# Altium project GNSS_Compass.PrjPcb
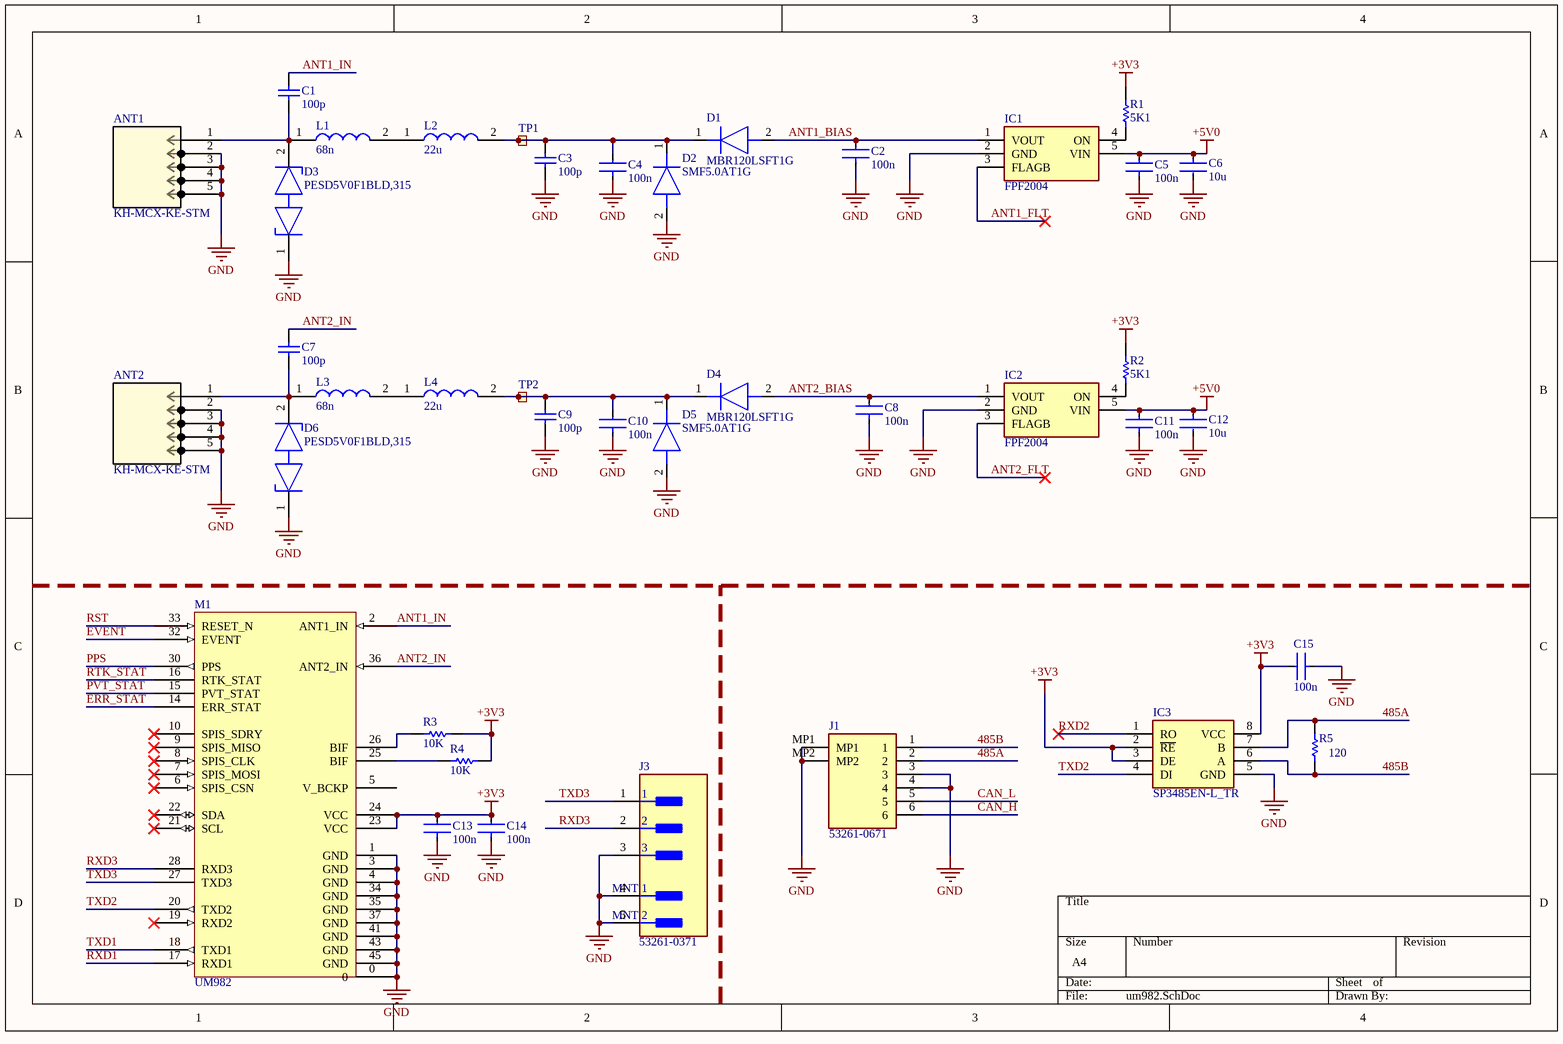
[diagram p0: um982.SchDoc]
3 sheets, 81 parts. Net scope: global (net labels, ports and power ports of the same name join across sheets).
Board file: um982.PcbDoc
Sheets:
  um982.SchDoc
  IMU.SchDoc
  POWER.SchDoc

## Sheet um982.SchDoc
size A4; SheetNumber: 1; SheetTotal: 3

### Parts
ANT1  KH-MCX-KE-STM  [MCX-SMD_KH-MCX-KE-STM]
ANT2  KH-MCX-KE-STM  [MCX-SMD_KH-MCX-KE-STM]
C1  value 100p  [CAPC1005X55X25ML05T10]  (hidden comment: GRM1555C1H101JA01D)
C2  value 100n  [FP-C1005-050-0_05-IPC_C]  (hidden comment: C1005X7R1H104K050BB)
C3  value 100p  [CAPC1005X55X25ML05T10]  (hidden comment: GRM1555C1H101JA01D)
C4  value 100n  [FP-C1005-050-0_05-IPC_A]  (hidden comment: C1005X7R1H104K050BB)
C5  value 100n  [FP-C1005-050-0_05-IPC_C]  (hidden comment: C1005X7R1H104K050BB)
C6  value 10u  [FP-C1608-080-IPC_A]  (hidden comment: C1608X5R1E106M080AC)
C7  value 100p  [CAPC1005X55X25ML05T10]  (hidden comment: GRM1555C1H101JA01D)
C8  value 100n  [FP-C1005-050-0_05-IPC_C]  (hidden comment: C1005X7R1H104K050BB)
C9  value 100p  [CAPC1005X55X25ML05T10]  (hidden comment: GRM1555C1H101JA01D)
C10  value 100n  [FP-C1005-050-0_05-IPC_A]  (hidden comment: C1005X7R1H104K050BB)
C11  value 100n  [FP-C1005-050-0_05-IPC_C]  (hidden comment: C1005X7R1H104K050BB)
C12  value 10u  [FP-C1608-080-IPC_A]  (hidden comment: C1608X5R1E106M080AC)
C13  value 100n  [FP-C1005-050-0_05-IPC_A]  (hidden comment: C1005X7R1H104K050BB)
C14  value 100n  [FP-C1005-050-0_05-IPC_A]  (hidden comment: C1005X7R1H104K050BB)
C15  value 100n  [FP-C1005-050-0_05-IPC_C]  (hidden comment: C1005X7R1H104K050BB)
D1  MBR120LSFT1G  [SODFL3616X98N]
D2  SMF5.0AT1G  [SODFL3616X98N]
D3  PESD5V0F1BLD,315  [FP-SOD882D-MFG]
D4  MBR120LSFT1G  [SODFL3616X98N]
D5  SMF5.0AT1G  [SODFL3616X98N]
D6  PESD5V0F1BLD,315  [FP-SOD882D-MFG]
IC1  FPF2004  [SOT65P210X110-5N]
IC2  FPF2004  [SOT65P210X110-5N]
IC3  SP3485EN-L_TR  [SOIC127P600X175-8N]
J1  53261-0671  [532610671]
J3  53261-0371  [FP-53261-0371-MFG]
L1  value 68n  [LQG15WH0N7B02D]  (hidden comment: LQG15HS68NJ02D)
L2  value 22u  [INDM4532X340N]  (hidden comment: NL453232T-220J-PF)
L3  value 68n  [LQG15WH0N7B02D]  (hidden comment: LQG15HS68NJ02D)
L4  value 22u  [INDM4532X340N]  (hidden comment: NL453232T-220J-PF)
M1  UM982  [UM982]
R1  value 5K1  [RESC1005X40X25NL05T10]  (hidden comment: RC0402FR-075K1L)
R2  value 5K1  [RESC1005X40X25NL05T10]  (hidden comment: RC0402FR-075K1L)
R3  value 10K  [RESC1005X40X25LL05T10]  (hidden comment: RC0402FR-0710KL)
R4  value 10K  [RESC1005X40X25LL05T10]  (hidden comment: RC0402FR-0710KL)
R5  value 120  [RESC1005X40X25NL05T10]  (hidden comment: RC0402FR-07120RL)
TP1  Ø1.0mm,SMD  [TP_SMD_Ø1.0mm]  (value not drawn)  (no BOM)
TP2  Ø1.0mm,SMD  [TP_SMD_Ø1.0mm]  (value not drawn)  (no BOM)

### Nets
+3V3: C13.2 C14.2 C15.2 IC3.2(~{RE}) IC3.3(DE) IC3.8(VCC) M1.23(VCC) M1.24(VCC) R1.1 R2.1 R3.1 R4.1
+5V0: C5.2 C6.1 C11.2 C12.1 IC1.5(VIN) IC2.5(VIN)
GND: ANT1.2(GND) ANT1.3(GND) ANT1.4(GND) ANT1.5(GND) ANT2.2(GND) ANT2.3(GND) ANT2.4(GND) ANT2.5(GND) C2.1 C3.2 C4.1 C5.1 C6.2 C8.1 C9.2 C10.1 C11.1 C12.2 C13.1 C14.1 C15.1 D2.2(A) D3.1(cathode(diode_1)) D5.2(A) D6.1(cathode(diode_1)) IC1.2(GND) IC2.2(GND) IC3.5(GND) J1.3 J1.4 J1.MP1 J1.MP2 J3.3 J3.4(MNT_1) J3.5(MNT_2) M1.0 M1.1(GND) M1.3(GND) M1.4(GND) M1.34(GND) M1.35(GND) M1.37(GND) M1.41(GND) M1.43(GND) M1.45(GND)
485A: IC3.7(B) J1.2 R5.2
485B: IC3.6(A) J1.1 R5.1
ANT1_BIAS: C2.2 D1.2(A) IC1.1(VOUT)
ANT1_FLT: IC1.3(FLAGB)
ANT1_IN: C1.2 M1.2(ANT1_IN)
ANT2_BIAS: C8.2 D4.2(A) IC2.1(VOUT)
ANT2_FLT: IC2.3(FLAGB)
ANT2_IN: C7.2 M1.36(ANT2_IN)
CAN_H: J1.6
CAN_L: J1.5
ERR_STAT: M1.14(ERR_STAT)
EVENT: M1.32(EVENT)
PPS: M1.30(PPS)
PVT_STAT: M1.15(PVT_STAT)
RST: M1.33(RESET_N)
RTK_STAT: M1.16(RTK_STAT)
RXD1: M1.17(RXD1)
RXD2: IC3.1(RO)
RXD3: J3.2 M1.28(RXD3)
TXD1: M1.18(TXD1)
TXD2: IC3.4(DI) M1.20(TXD2)
TXD3: J3.1 M1.27(TXD3)
NetANT1_1: ANT1.1(SIGNAL) C1.1 D3.2(cathode(diode_2)) L1.1
NetANT2_1: ANT2.1(SIGNAL) C7.1 D6.2(cathode(diode_2)) L3.1
NetC3_1: C3.1 C4.2 D1.1(K) D2.1(K) L2.2 TP1.1
NetC9_1: C9.1 C10.2 D4.1(K) D5.1(K) L4.2 TP2.1
NetIC1_4: IC1.4(ON) R1.2
NetIC2_4: IC2.4(ON) R2.2
NetL1_2: L1.2 L2.1
NetL3_2: L3.2 L4.1
NetM1_25: M1.25(BIF) R4.2
NetM1_26: M1.26(BIF) R3.2

Not connected (* = marked no-connect by the designer): M1 5(V_BCKP) 6(SPIS_CSN)* 7(SPIS_MOSI)* 8(SPIS_CLK)* 9(SPIS_MISO)* 10(SPIS_SDRY)* 19(RXD2)* 21(SCL)* 22(SDA)*

### Library data of the parts
ANT1 ANT2 = 919-415J-71P12G: No Description Available; Manufacturer_Name: Amphenol ICC; Type: Coaxial Connectors(RF) Assemblies; Copyright: Copyright (C) 2025 Ultra Librarian. All rights reserved.; Manufacturer_Part_Number: 919-415J-71P12G; RefDes: RefDes
C1 C3 C7 C9 = CMP-2008-03915-1: Manufacturer: Murata; Part Number: GRM1555C1H101JA01D
C2 C4 C5 C8 C10 C11 C13-C15 = CMP-2000-05393-2: Multilayer Ceramic Capacitors 100nF ±10% 50V X7R SMD 0402; Voltage: 50V; Dielectric Material: Ceramic; Min Operating Temperature: -55°C; Depth: 0.5mm; Radiation Hardening: No; RoHS Compliant: Yes; Voltage Rating (DC): 50V; Lead Free: Lead Free; Resistor Type: Ceramic; Height: 0.5mm; Dielectric: X7R; Thickness: 0.022inch; Case/Package: 0402; Case Code (Metric): 1005; Termination: SMD/SMT; Capacitance: 100nF; Packaging: Tape and Reel; Max Operating Temperature: 125°C; Mount: Surface Mount; Package Quantity: 1; Width: 0.02inch; Weight: 2.3E-05oz; Voltage Rating: 50V; Tolerance: 10%; Construction: Flat; Case Code (Imperial): 0402; Length: 1mm; REACH SVHC: No SVHC; Series: C
C6 C12 = CMP-2000-05442-2: CAP CER 10UF 25V X5R 0603; Dielectric Material: Ceramic; Tolerance: 20%; Dielectric: X5R; Length: 1.6mm; Termination: SMD/SMT; Depth: 0.8mm; RoHS Compliant: Yes; Construction: Flat; Weight: 7.1E-05oz; Thickness: 0.039inch; Packaging: Tape and Reel; Min Operating Temperature: -55°C; Case Code (Imperial): 0603; Case/Package: 0603; Height: 0.8mm; Case Code (Metric): 1608; Voltage Rating: 25V; Resistor Type: Ceramic; Voltage Rating (DC): 25V; Max Operating Temperature: 85°C; REACH SVHC: No SVHC; Lead Free: Lead Free; Series: C; Width: 0.8mm; Mount: Surface Mount; Package Quantity: 1; Capacitance: 10uF
D1 D4 = MBR120LSFT1G: Diode; Manufacturer_Name: onsemi; Datasheet Link: https://www.onsemi.com/pub/Collateral/MBR120LSFT1-D.PDF; Height: 0.98mm; Manufacturer_Part_Number: MBR120LSFT1G; Mouser Part Number: 863-MBR120LSFT1G; Mouser Price/Stock: https://www.mouser.co.uk/ProductDetail/onsemi/MBR120LSFT1G?qs=3JMERSakebpX1t8rvRkaxg%3D%3D; Arrow Part Number: MBR120LSFT1G; Arrow Price/Stock: https://www.arrow.com/en/products/mbr120lsft1g/on-semiconductor?utm_currency=USD&region=nac
D2 D5 = SMF5.0AT1G: Diode; Manufacturer_Name: onsemi; Datasheet Link: https://datasheet.datasheetarchive.com/originals/distributors/SFDatasheet-3/sf-00077388.pdf; Height: 0.98mm; Manufacturer_Part_Number: SMF5.0AT1G; Mouser Part Number: 863-SMF5.0AT1G; Mouser Price/Stock: http://www.mouser.com/Search/ProductDetail.aspx?qs=OSf9jACorva5lys2KCgYOA%3d%3d
D3 D6 = CMP-14432-000003-1: TVS DIODE 5.5V 15V 2DFN1006D; RoHS Compliant: Yes
IC1 IC2 = FPF2004: Integrated Circuit; Manufacturer_Name: onsemi; Datasheet Link: https://www.onsemi.com/pub/Collateral/FPF2001-D.PDF; Height: 1.1mm; Manufacturer_Part_Number: FPF2004; Mouser Part Number: 512-FPF2004; Mouser Price/Stock: https://www.mouser.co.uk/ProductDetail/onsemi-Fairchild/FPF2004?qs=lYuAOLy5nvYlXtSUPYB80A%3D%3D; Arrow Part Number: FPF2004; Arrow Price/Stock: https://www.arrow.com/en/products/fpf2004/on-semiconductor
IC3 = SP3485EN-L_TR: Integrated Circuit; Manufacturer_Name: MaxLinear; Manufacturer_Part_Number: SP3485EN-L/TR; Datasheet Link: https://www.maxlinear.com/ds/sp3485.pdf; Height: 1.75mm; Mouser Part Number: 701-SP3485EN-L/TR; Mouser Price/Stock: https://www.mouser.co.uk/ProductDetail/MaxLinear/SP3485EN-L-TR?qs=3EMgrMjM0fbQ17liGrle%2Fg%3D%3D; Arrow Part Number: SP3485EN-L/TR; Arrow Price/Stock: https://www.arrow.com/en/products/sp3485en-ltr/maxlinear-inc?region=nac
J1 = 53261-0671: Connector; Manufacturer_Name: Molex; Datasheet Link: https://www.molex.com/pdm_docs/sd/532610671_sd.pdf; Height: 3.6mm; Manufacturer_Part_Number: 53261-0671; Mouser Part Number: 538-53261-0671; Mouser Price/Stock: https://www.mouser.co.uk/ProductDetail/Molex/53261-0671?qs=%252B72YyncTwW9Wyr77z4J2cA%3D%3D; Arrow Part Number: 53261-0671; Arrow Price/Stock: https://www.arrow.com/en/products/53261-0671/molex?region=nac
J3 = CMP-04776-000071-1: CONN HEADER SMD R/A 3POS 1.25MM; Manufacturer: Molex; Number Of Contacts: 3; Conn Orientation: Right Angle; Current Rating: 1A; Voltage Rating: 125V; Conn Gender: Male; Category: Conn; Automotive: No; Footprint Url: https://www.molex.com/pdm_docs/sd/532610371_sd.pdf; Height: 3.6mm; Number Of Rows: 1; Temperature Range Low: -40°C; Package: 0; Octopart: https://octopart.com/53261-0371-molex-655314; ComponentLink2Description: Datasheet; Lead Free: Yes; Ambient Temperature Range Low: -40°C; Device Class L3: unset; Mouser Description: 1.25mm (.049") Pitch PicoBlade Header, Surface Mount, Right Angle, Lead-free, 3 Circuits; Digikey Description: CONN HEADER SMD R/A 3POS 1.25MM; Device Class L2: Headers and Wire Housings; Contact Material: Tin,Nickel; Manufacturer Part Number: 53261-0371; Ambient Temperature Range High: +105°C; ComponentLink2URL: https://www.molex.com/webdocs/datasheets/pdf/en-us/0532610371_PCB_HEADERS.pdf; Pitch: 1.25mm; Temperature: -40°C to +105°C; RoHS: TRUE; Device Class L1: Connectors; Temperature Range High: +105°C
L1 L3 = LQG15HS68NJ02D: Inductor; Manufacturer_Name: Murata Electronics; Datasheet Link: https://search.murata.co.jp/Ceramy/image/img/P02/JELF243B-0010.pdf; Height: 0.6mm; Manufacturer_Part_Number: LQG15HS68NJ02D; Mouser Part Number: 81-LQG15HS68NJ02D; Mouser Price/Stock: https://www.mouser.co.uk/ProductDetail/Murata-Electronics/LQG15HS68NJ02D?qs=%252BvdzeT3otYvc8aHGlFkb4Q%3D%3D; Arrow Part Number: LQG15HS68NJ02D; Arrow Price/Stock: https://www.arrow.com/en/products/lqg15hs68nj02d/murata-manufacturing?region=nac
L2 L4 = NL453232T-220J-PF: Inductor; Manufacturer_Name: TDK; Datasheet Link: https://product.tdk.com/system/files/dam/doc/product/inductor/inductor/smd/catalog/inductor_commercial_standard_nl453232_en.pdf; Height: 3.4mm; Manufacturer_Part_Number: NL453232T-220J-PF; Mouser Part Number: 810-NL453232T-220JPF; Mouser Price/Stock: https://www.mouser.co.uk/ProductDetail/TDK/NL453232T-220J-PF?qs=qikLf3I1oVVds9cZ5k413A%3D%3D; Arrow Part Number: NL453232T-220J-PF; Arrow Price/Stock: https://www.arrow.com/en/products/nl453232t-220j-pf/tdk
M1 = UM982: All-constellation Multi-frequencyHigh Precision Positioning & Heading Module
R1 R2 = CMP-2002-07753-1: Manufacturer: Yageo / Phycomp; Part Number: RC0402FR-075K1L
R3 R4 = CMP-2002-07353-1: Manufacturer: Yageo / Phycomp; Part Number: RC0402FR-0710KL
R5 = CMP-2002-07370-1: Manufacturer: Yageo / Phycomp; Part Number: RC0402FR-07120RL
TP1 TP2 = TP_SMD_Ø1.0MM: 1.0mm circular SMD testpad; Manufacturer: Nordic Semiconductor; Manufacturer Part Number: N.A.; Pad Count: 1; Part Number: TP_SMD_Ø1.0MM; LatestRevisionDate: 2013-06-11; Published: 2013-06-11; Value: Ø1.0mm,SMD; Note: N.A.; Artikkelnr Noca: N.A.; Footprint Doc: TP_SMD_Ø1.0mm; Part number IPS: N.A.; ComponentLink1URL: N.A.; ComponentLink1Description: Datasheet; ComponentLink2URL: N.A.; ComponentLink2Description: Supplier link; HelpURL: N.A.; Supplier 1: N.A.; Supplier Part Number 1: N.A.; Supplier 2: N.A.; Supplier Part Number 2: N.A.; Component Class: Connectors; PartId: 100500475

## Sheet IMU.SchDoc
size A; SheetNumber: 2; SheetTotal: 3
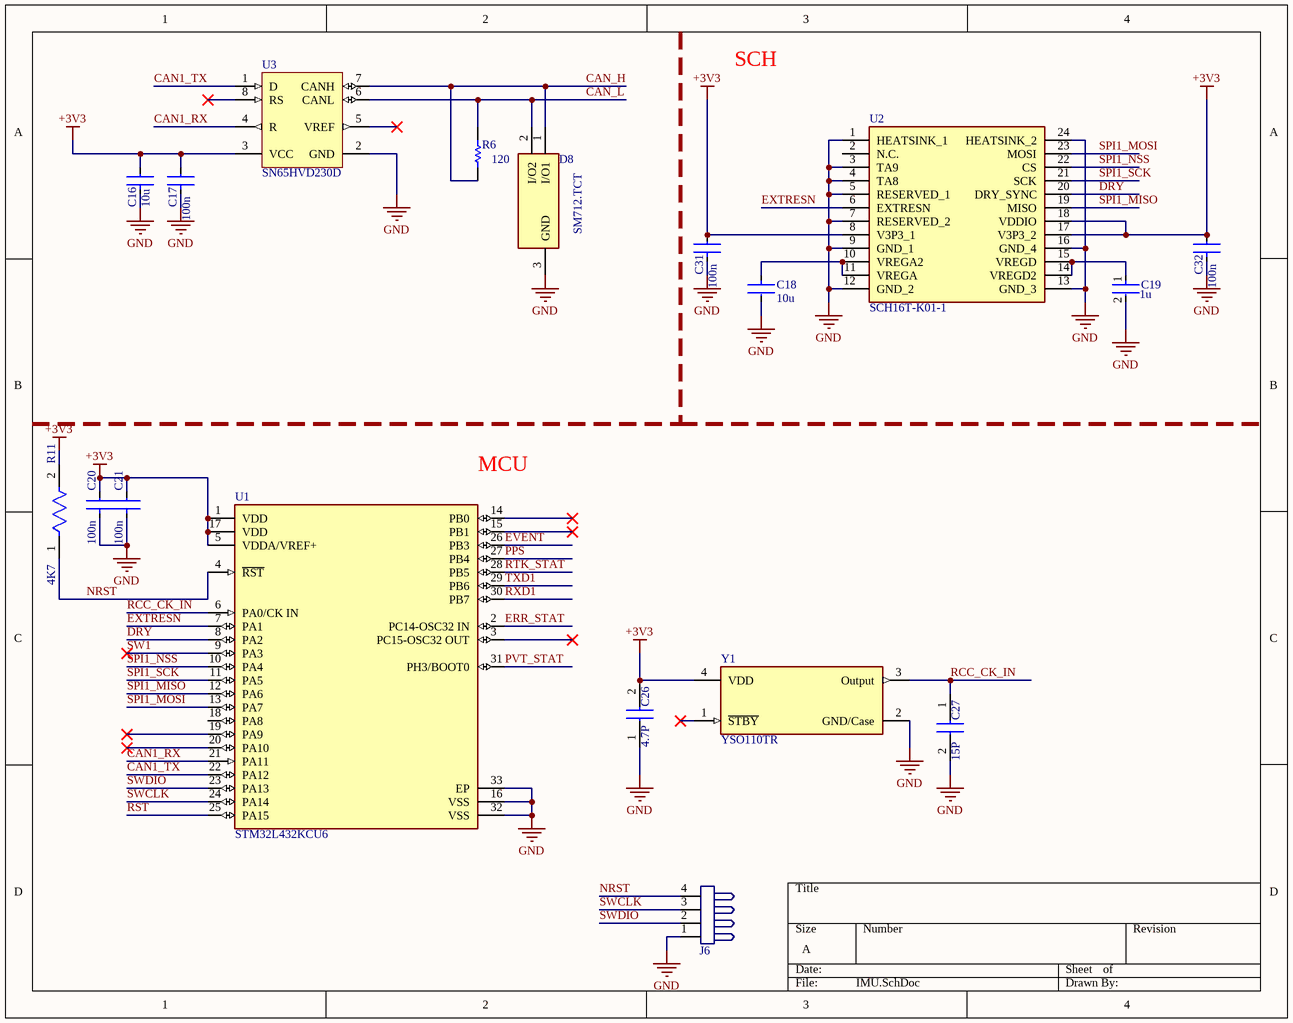
[diagram p1: IMU.SchDoc]

### Parts
C16  value 10u  [FP-C1608-080-IPC_A]  (hidden comment: C1608X5R1E106M080AC)
C17  value 100n  [FP-C1005-050-0_05-IPC_C]  (hidden comment: C1005X7R1H104K050BB)
C18  value 10u  [FP-C1608-080-IPC_A]  (hidden comment: C1608X5R1E106M080AC)
C19  Capacitance: 1u  [FP-C1005-050-0_05-IPC_C]  (hidden comment: C1005X5R1V105K050BC)
C20  value 100n  [FP-C1005-050-0_05-IPC_C]  (hidden comment: C1005X7R1H104K050BB)
C21  value 100n  [FP-C1005-050-0_05-IPC_C]  (hidden comment: C1005X7R1H104K050BB)
C26  value 4.7P  [CAPC1005X55N]  (hidden comment: CC0402BRNPO9BN4R7)
C27  value 15P  [CAPC1005X55N]  (hidden comment: CC0402JRNPO8BN150)
C31  value 100n  [FP-C1005-050-0_05-IPC_C]  (hidden comment: C1005X7R1H104K050BB)
C32  value 100n  [FP-C1005-050-0_05-IPC_C]  (hidden comment: C1005X7R1H104K050BB)
D8  SM712.TCT  [SOT95P237X112-3N]
J6  PHDR 4  [PHDR2X2]  (value not drawn)
R6  value 120  [RESC1005X40X25NL05T10]  (hidden comment: RC0402FR-07120RL)
R11  value 4K7  [FP-RC0402-0_4-MFG]  (hidden comment: RC0402JR-074K7L)
U1  STM32L432KCU6  [FP-UFQFPN32-A0B8-MFG]
U2  SCH16T-K01-1  [SCH16TK011]
U3  SN65HVD230D  [D0008A_M]
Y1  YSO110TR  [FP-ASE-MFG]

### Nets
+3V3: C16.2 C17.2 C20.2 C21.2 C26.2 C31.2 C32.2 R11.2 U1.1(VDD) U1.5(VDDA/VREF+) U1.17(VDD) U2.8(V3P3_1) U2.17(V3P3_2) U2.18(VDDIO) U3.3(VCC) Y1.4(VDD)
GND: C16.1 C17.1 C18.2 C19.2 C20.1 C21.1 C26.1 C27.2 C31.1 C32.1 D8.3(GND) J6.1 U1.16(VSS) U1.32(VSS) U1.33(EP) U2.1(HEATSINK_1) U2.3(TA9) U2.4(TA8) U2.5(RESERVED_1) U2.7(RESERVED_2) U2.9(GND_1) U2.12(GND_2) U2.13(GND_3) U2.16(GND_4) U2.24(HEATSINK_2) U3.2(GND) Y1.2(GND/Case)
CAN1_RX: U1.21(PA11) U3.4(R)
CAN1_TX: U1.22(PA12) U3.1(D)
CAN_H: D8.1(I/O1) R6.1 U3.7(CANH)
CAN_L: D8.2(I/O2) R6.2 U3.6(CANL)
DRY: U1.8(PA2) U2.20(DRY_SYNC)
ERR_STAT: U1.2(PC14-OSC32_IN)
EVENT: U1.26(PB3)
EXTRESN: U1.7(PA1) U2.6(EXTRESN)
NRST: J6.4 R11.1 U1.4(~{RST})
PPS: U1.27(PB4)
PVT_STAT: U1.31(PH3/BOOT0)
RCC_CK_IN: C27.1 U1.6(PA0/CK_IN) Y1.3(Output)
RST: U1.25(PA15)
RTK_STAT: U1.28(PB5)
RXD1: U1.30(PB7)
SPI1_MISO: U1.12(PA6) U2.19(MISO)
SPI1_MOSI: U1.13(PA7) U2.23(MOSI)
SPI1_NSS: U1.10(PA4) U2.22(CS)
SPI1_SCK: U1.11(PA5) U2.21(SCK)
SW1: U1.9(PA3)
SWCLK: J6.3 U1.24(PA14)
SWDIO: J6.2 U1.23(PA13)
TXD1: U1.29(PB6)
NetC18_1: C18.1 U2.10(VREGA2) U2.11(VREGA)
NetC19_1: C19.1 U2.14(VREGD2) U2.15(VREGD)

Not connected (* = marked no-connect by the designer): U1 3(PC15-OSC32_OUT)* 14(PB0)* 15(PB1)* 18(PA8) 19(PA9)* 20(PA10)*; U2 2(N.C.); U3 5(VREF)* 8(RS)*; Y1 1(~{STBY})*

### Notes on the sheet
- SCH
- (near U1) MCU

### Library data of the parts
C16 C18 = CMP-2000-05442-2: as C6 on sheet um982; Dielectric: X5R; Length: 1.6mm; Termination: SMD/SMT; Depth: 0.8mm; RoHS Compliant: Yes; Construction: Flat; Weight: 7.1E-05oz; Thickness: 0.039inch; Packaging: Tape and Reel; Min Operating Temperature: -55°C; Case Code (Imperial): 0603; Case/Package: 0603; Height: 0.8mm; Case Code (Metric): 1608; Voltage Rating: 25V; Resistor Type: Ceramic; Voltage Rating (DC): 25V; Max Operating Temperature: 85°C; REACH SVHC: No SVHC; Lead Free: Lead Free; Series: C; Width: 0.8mm; Mount: Surface Mount; Package Quantity: 1; Capacitance: 10uF
C17 C20 C21 C31 C32 = CMP-2000-05393-2: as C2 on sheet um982; Voltage: 50V; Dielectric Material: Ceramic; Min Operating Temperature: -55°C; Depth: 0.5mm; Radiation Hardening: No; RoHS Compliant: Yes; Voltage Rating (DC): 50V; Lead Free: Lead Free; Resistor Type: Ceramic; Height: 0.5mm; Dielectric: X7R; Thickness: 0.022inch; Case/Package: 0402; Case Code (Metric): 1005; Termination: SMD/SMT; Capacitance: 100nF; Packaging: Tape and Reel; Max Operating Temperature: 125°C; Mount: Surface Mount; Package Quantity: 1; Width: 0.02inch; Weight: 2.3E-05oz; Voltage Rating: 50V; Tolerance: 10%; Construction: Flat; Case Code (Imperial): 0402; Length: 1mm; REACH SVHC: No SVHC; Series: C
C19 = CMP-2000-06004-2: Multilayer Ceramic Capacitors 1μF ±10% 35V X5R SMD 0402; Series: C; Voltage Rating (DC): 35V; Max Operating Temperature: 85°C; Resistor Type: Ceramic; REACH SVHC: No SVHC; Package Quantity: 1; Packaging: Tape and Reel; Termination: SMD/SMT; Dielectric Material: Ceramic; Height: 0.5mm; Length: 1mm; Min Operating Temperature: -55°C; Dielectric: X5R; Thickness: 0.022inch; Lead Free: Lead Free; Voltage Rating: 35V; Width: 0.02inch; Depth: 0.5mm; Case Code (Imperial): 0402; Case/Package: 0402; Tolerance: 10%; Weight: 2.3E-05oz; Radiation Hardening: No; RoHS Compliant: Yes; Case Code (Metric): 1005; Mount: Surface Mount
C26 = CC0402BRNPO9BN4R7: Capacitor; Manufacturer_Name: KEMET; Datasheet Link: https://4donline.ihs.com/images/VipMasterIC/IC/YAGO/YAGO-S-A0009251638/YAGO-S-A0009251638-1.pdf?hkey=6D3A4C79FDBF58556ACFDE234799DDF0; Height: 0.55mm; Manufacturer_Part_Number: CC0402BRNPO9BN4R7; Mouser Part Number: 603-CC402BRNPO9BN4R7; Mouser Price/Stock: https://www.mouser.co.uk/ProductDetail/Yageo/CC0402BRNPO9BN4R7?qs=AgBp2OyFlx%2FGrCNlQaiLcg%3D%3D; Arrow Part Number: CC0402BRNPO9BN4R7; Arrow Price/Stock: https://www.arrow.com/en/products/cc0402brnpo9bn4r7/yageo
C27 = CC0402JRNPO8BN150: Capacitor; Manufacturer_Name: KEMET; Datasheet Link: https://www.mouser.com/datasheet/2/447/UPY-GP_NP0_16V-to-50V_16-1109089.pdf; Height: 0.55mm; Manufacturer_Part_Number: CC0402JRNPO8BN150; Mouser Part Number: 603-CC402JRNPO8BN150; Mouser Price/Stock: https://www.mouser.com/Search/Refine.aspx?Keyword=603-CC402JRNPO8BN150; Arrow Part Number: CC0402JRNPO8BN150; Arrow Price/Stock: https://www.arrow.com/en/products/cc0402jrnpo8bn150/yageo
D8 = SM712.TCT: Diode; Manufacturer_Name: SEMTECH; Datasheet Link: https://datasheet.datasheetarchive.com/originals/distributors/Datasheets-30/DSA-588511.pdf; Height: 1.12mm; Manufacturer_Part_Number: SM712.TCT; Mouser Part Number: 947-SM712.TCT; Mouser Price/Stock: https://www.mouser.co.uk/ProductDetail/Semtech/SM712.TCT?qs=rBWM4%252BvDhIfYU4k7Soov1w%3D%3D; Arrow Part Number: SM712.TCT; Arrow Price/Stock: https://www.arrow.com/en/products/sm712.tct/semtech?utm_currency=USD&region=nac
J6 = PHDR 4: PinHeader
R6 = CMP-2002-07370-1: Manufacturer: Yageo / Phycomp; Part Number: RC0402FR-07120RL
R11 = CMP-2002-08011-2: Tolerance: 5%; Power Rating: 63mW; Voltage Rating: 50V; Temperature Coefficient: 100ppm/°C; Composition: Thick Film; Max Operating Temperature: 155°C; Case/Package: 0402; Depth: 500µm; Packaging: Tape & Reel; Number of Pins: 2; Schedule B: 8533210045, 8533210045; Case Code (Imperial): 0402; Termination: SMD/SMT; Military Standard: Not; Lead Free: Lead Free; Width: 500µm; REACH SVHC: No SVHC; Max Power Dissipation: 63mW; Voltage Rating (AC): 50V; Features: Moisture Resistant; Min Operating Temperature: -55°C; Number of Terminations: 2; RoHS: Compliant; Height: 350µm; Voltage Rating (DC): 50V; Length: 1mm
U1 = CMP-12105-000033-1: IC MCU 32BIT 256KB FLASH 32QFPN; Manufacturer: STMicroelectronics; Max Supply Voltage: 3.6V; Number Of Timers/Counters: 11; Ram Size: 64KBytes; Number Of Usb Channels: 1; Memory Size: 256KBytes; Number Of Uart Channels: 3; Frequency: 80MHz; Number Of I2C Channels: 2; Core Architecture: ARM Cortex-M4; Number Of I/Os: 26; Min Supply Voltage: 1.62V; Data Bus Width: 32bits; Max Junction Temp: +105°C; Interface: I2C,SPI,UART,USART,CAN,USB,LIN,IrDA,Other; Ambient Temperature Range High: +85°C; Category: IC; Device Class L2: Embedded Processors and Controllers; Ambient Temperature Range Low: -40°C; Number Of Adc Channels: 11; ComponentLink2Description: Datasheet; Number Of A/D Converters: 1; Device Class L1: Integrated Circuits (ICs); Memory Type: FLASH; Height: 0.6mm; Temperature: -40°C to +105°C; Automotive: No; Temperature Range Low: -40°C; Digikey Description: IC MCU 32BIT 256KB FLASH 32QFPN; Manufacturer Part Number: STM32L432KCU6; Temperature Range High: +105°C; Octopart: https://octopart.com/stm32l432kcu6-stmicroelectronics-71093510; Device Class L3: Microcontrollers; Number Of Pwm Channels: 1; Number Of Spi Channels: 2; Lead Free: Yes; Number Of Cores: 1; Package: UFQFPN32-A0B8; ComponentLink2URL: https://www.st.com/content/ccc/resource/technical/document/datasheet/24/01/9f/59/f0/83/47/fc/DM00257205.pdf/files/DM00257205.pdf/jcr:content/translations/en.DM00257205.pdf; RoHS: TRUE
U2 = SCH16T-K01-1: Undefined or Miscellaneous; Manufacturer_Name: Murata Electronics; Datasheet Link: https://www.murata.com/-/media/webrenewal/products/sensor/pdf/datasheet/datasheet-sch16t-series-short.ashx?la=en-us&cvid=20240110024121000000; Height: 3mm; Manufacturer_Part_Number: SCH16T-K01-1; Mouser Part Number: 81-SCH16T-K01-1; Mouser Price/Stock: https://www.mouser.co.uk/ProductDetail/Murata-Electronics/SCH16T-K01-1?qs=HFfMDpzxxd0hctvcENbFhg%3D%3D; Arrow Part Number: SCH16T-K01-1; Arrow Price/Stock: https://www.arrow.com/en/products/sch16t-k01-1/murata-manufacturing?utm_currency=USD&region=nac
U3 = CMP-0315-00046-3: CAN Bus Transceiver, 3.3 V, -40 to 85 degC, 8-Pin SOIC (D), Green (RoHS & no Sb/Br), Tube; Supply Voltage Min: 3 V; Supply Voltage Max: 3.6 V; PartNumber: SN65HVD230D; ComponentLink2URL: http://www.ti.com/general/docs/lit/getliterature.tsp?genericGeneric Part Number=SN65HVD230&fileType=pdf; DatasheetVersion: SLOS346N; Generic Part Number: SN65HVD230; Packing: Tube; Temperature Min: -40 degC; Temperature Max: 85 degC; ComponentLink1Description: Manufacturer URL; Mounting Technology: Surface Mount; RoHS: TRUE; ComponentLink1URL: http://www.ti.com/; ComponentLink2Description: Datasheet; PackageDescription: 8-Pin Plastic Small Outline, Body 4.9 x 3.9 mm, Pitch 1.27 mm
Y1 = CMP-27762-009764-1: XTAL Oscillator 50MHz ±50ppm CMOS 3.3V 4-SMD 3.2mm x 2.5mm; Load Capacitance: 15pF; Max Supply Current: 19mA; Min Supply Voltage: 3.135V; Max Supply Voltage: 3.465V; Packaging: Tape and Reel; Height: 0.047inch; Mount: Surface Mount; Frequency Stability: 50ppm; Lead Free: Lead Free; Number of Pins: 4; Width: 0.098inch; Radiation Hardening: No; Max Operating Temperature: 85°C; Length: 3.2mm; REACH SVHC: No SVHC; Series: ASE; Depth: 2.5mm; Operating Supply Voltage: 3.3V; Min Operating Temperature: -40°C; Package Quantity: 1000; Operating Frequency: 50 MHz; Case/Package: SMD/SMT; Termination: SMD/SMT; Frequency: 50MHz

## Sheet POWER.SchDoc
size A; SheetNumber: 3; SheetTotal: 3
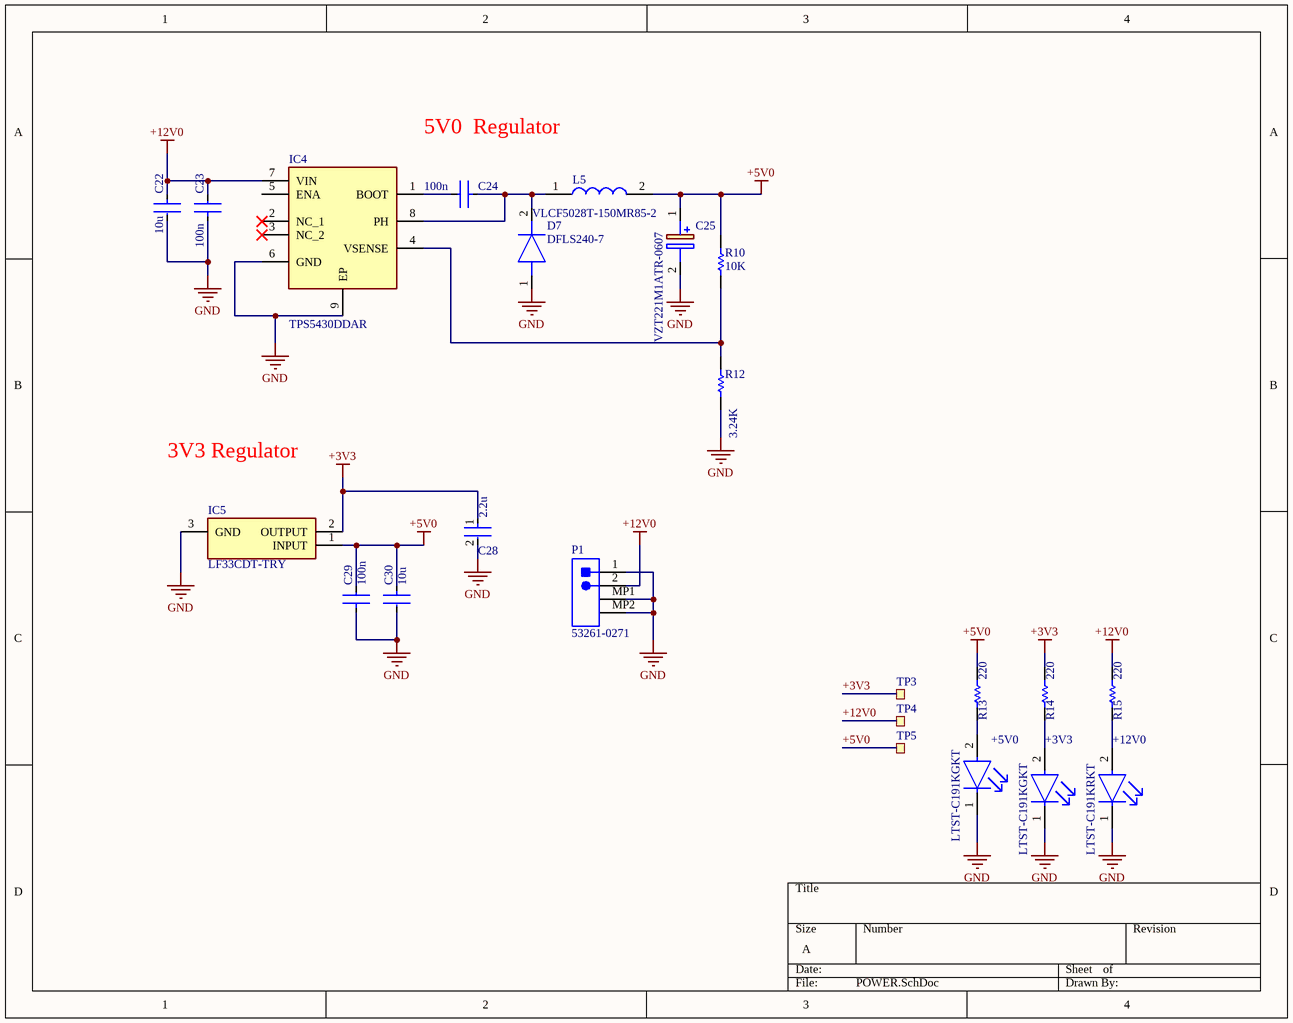
[diagram p2: POWER.SchDoc]

### Parts
+3V3  LTST-C191KGKT  [FP-LTST-C191KGKT-MFG]
+5V0  LTST-C191KGKT  [FP-LTST-C191KGKT-MFG]
+12V0  LTST-C191KRKT  [FP-LTST-C191KRKT-MFG]
C22  value 10u  [FP-C1608-080-IPC_A]  (hidden comment: C1608X5R1E106M080AC)
C23  value 100n  [FP-C1005-050-0_05-IPC_C]  (hidden comment: C1005X7R1H104K050BB)
C24  value 100n  [FP-C1005-050-0_05-IPC_C]  (hidden comment: C1005X7R1H104K050BB)
C25  VZT221M1ATR-0607  [CAPAE660X800N]
C28  Capacitance: 2.2u  [FP-C1005-050-0_15-IPC_A]  (hidden comment: C1005X5R1V225K050BC)
C29  value 100n  [FP-C1005-050-0_05-IPC_C]  (hidden comment: C1005X7R1H104K050BB)
C30  value 10u  [FP-C1608-080-IPC_A]  (hidden comment: C1608X5R1E106M080AC)
D7  DFLS240-7  [POWERDI123]
IC4  TPS5430DDAR  [SOIC127P600X170-9N]
IC5  LF33CDT-TRY  [LD1117DT33]
L5  VLCF5028T-150MR85-2  [VLCF5028]
P1  53261-0271  [MOLX-53261-0271_V]
R10  value 10K  [RESC1005X40X25LL05T10]  (hidden comment: RC0402FR-0710KL)
R12  value 3.24K  [RESC1005X40X25ML05T10]  (hidden comment: RC0402FR-073K24L)
R13  vlue: 220  [RESC1005X40X25ML05T10]  (hidden comment: RC0402FR-13220RL)
R14  vlue: 220  [RESC1005X40X25ML05T10]  (hidden comment: RC0402FR-13220RL)
R15  vlue: 220  [RESC1005X40X25ML05T10]  (hidden comment: RC0402FR-13220RL)
TP3  Ø1.5mm,SMD  [TP_SMD_Ø1.5mm]  (value not drawn)  (no BOM)
TP4  Ø1.5mm,SMD  [TP_SMD_Ø1.5mm]  (value not drawn)  (no BOM)
TP5  Ø1.5mm,SMD  [TP_SMD_Ø1.5mm]  (value not drawn)  (no BOM)

### Nets
+3V3: C28.1 IC5.2(OUTPUT) R14.2 TP3.1
+5V0: C25.1(+) C29.2 C30.1 IC5.1(INPUT) L5.2 R10.1 R13.2 TP5.1
+12V0: C22.1 C23.2 IC4.7(VIN) P1.2 R15.2 TP4.1
GND: +3V3.1(C) +5V0.1(C) +12V0.1(C) C22.2 C23.1 C25.2(-) C28.2 C29.1 C30.2 D7.1(A) IC4.6(GND) IC4.9(EP) IC5.3(GND) P1.1 P1.MP1 P1.MP2 R12.1
Net+3V3_2: +3V3.2(A) R14.1
Net+5V0_2: +5V0.2(A) R13.1
Net+12V0_2: +12V0.2(A) R15.1
NetC24_1: C24.1 D7.2(K) IC4.8(PH) L5.1
NetC24_2: C24.2 IC4.1(BOOT)
NetIC4_4: IC4.4(VSENSE) R10.2 R12.2

Not connected (* = marked no-connect by the designer): IC4 2(NC_1)* 3(NC_2)* 5(ENA)

### Notes on the sheet
- 5V0  Regulator
- 3V3 Regulator

### Library data of the parts
+3V3 +5V0 = CMP-2000-05198-4: NexarPartId: 549907; Forward Voltage: 2V; Viewing Angle: 130°; Lens Transparency: Clear; Power Rating: 75mW; Number of LEDs: 1; Luminous Intensity: 35mcd; Forward Current: 20mA; Dominant Wavelength: 571nm; Illumination Color: Green; Lens Color: Clear, Colorless; Reverse Voltage: 5V; Wavelength: 574nm; Number of Pins: 2; Packaging: Tape and Reel; Number of Elements: 1; Schedule B: 8541402000, 8541402000; Height: 550µm; Case/Package: 0603; Depth: 800µm; Max Operating Temperature: 85°C; RoHS: Compliant; Lens Style: Clear; Lead Free: Lead Free; Length: 1.6mm; Mount: Surface Mount; Test Current: 20mA; Width: 800µm; Case Code (Imperial): 0603; Min Operating Temperature: -55°C; Case Code (Metric): 1608; Radiation Hardening: No; Power Dissipation: 75mW; Color: Green
+12V0 = CMP-2000-05199-2: NexarPartId: 549908; Illumination Color: Red; Lens Transparency: Clear; Luminous Intensity: 54mcd; Current: 2A; Forward Current: 20mA; Number of Elements: 1; Power Rating: 75mW; Lens Color: Colorless; Wavelength: 639nm; Viewing Angle: 130°; Voltage: 2V; Dominant Wavelength: 631nm; Reverse Voltage: 5V; Height: 550µm; Length: 1.6mm; Number of Pins: 2; Packaging: Tape and Reel; Mount: Surface Mount; Case Code (Metric): 1608; Radiation Hardening: No; Case Code (Imperial): 0603; Test Current: 20mA; Number of LEDs: 1; Schedule B: 8541402000, 8541402000; Lead Free: Lead Free; Power Dissipation: 75mW; RoHS: Compliant; Forward Voltage: 2V; Lens Style: Clear; Color: Red; Max Operating Temperature: 85°C; Depth: 800µm; Width: 800µm; Min Operating Temperature: -55°C; Case/Package: 0603
C22 C30 = CMP-2000-05442-2: as C6 on sheet um982; Dielectric: X5R; Length: 1.6mm; Termination: SMD/SMT; Depth: 0.8mm; RoHS Compliant: Yes; Construction: Flat; Weight: 7.1E-05oz; Thickness: 0.039inch; Packaging: Tape and Reel; Min Operating Temperature: -55°C; Case Code (Imperial): 0603; Case/Package: 0603; Height: 0.8mm; Case Code (Metric): 1608; Voltage Rating: 25V; Resistor Type: Ceramic; Voltage Rating (DC): 25V; Max Operating Temperature: 85°C; REACH SVHC: No SVHC; Lead Free: Lead Free; Series: C; Width: 0.8mm; Mount: Surface Mount; Package Quantity: 1; Capacitance: 10uF
C23 C24 C29 = CMP-2000-05393-2: as C2 on sheet um982; Voltage: 50V; Dielectric Material: Ceramic; Min Operating Temperature: -55°C; Depth: 0.5mm; Radiation Hardening: No; RoHS Compliant: Yes; Voltage Rating (DC): 50V; Lead Free: Lead Free; Resistor Type: Ceramic; Height: 0.5mm; Dielectric: X7R; Thickness: 0.022inch; Case/Package: 0402; Case Code (Metric): 1005; Termination: SMD/SMT; Capacitance: 100nF; Packaging: Tape and Reel; Max Operating Temperature: 125°C; Mount: Surface Mount; Package Quantity: 1; Width: 0.02inch; Weight: 2.3E-05oz; Voltage Rating: 50V; Tolerance: 10%; Construction: Flat; Case Code (Imperial): 0402; Length: 1mm; REACH SVHC: No SVHC; Series: C
C25 = VZT221M1ATR-0607: Capacitor Polarised; Manufacturer_Name: Lelon; Datasheet Link: http://www.lelon.com/upload/prod/173631643921.pdf; Height: 8mm; Manufacturer_Part_Number: VZT221M1ATR-0607; Mouser Part Number: 140-VZT221M1ATR-0607; Mouser Price/Stock: https://www.mouser.co.uk/ProductDetail/Lelon/VZT221M1ATR-0607?qs=wd5RIQLrsJgJ%252BgwNNtmauQ%3D%3D
C28 = CMP-08246-007153-1: CAP CER 2.2UF 35V X5R 0402; Dielectric Material: Ceramic; Tolerance: 10%; Package Quantity: 1; Voltage Rating: 35V; Case Code (Metric): 1005; Width: 0.5mm; RoHS Compliant: Yes; Min Operating Temperature: -55°C; Packaging: Tape and Reel; Voltage Rating (DC): 35V; Thickness: 0.022inch; REACH SVHC: No SVHC; Max Operating Temperature: 85°C; Length: 1mm; Case Code (Imperial): 0402; Resistor Type: Ceramic; Lead Free: Lead Free; Series: C; Termination: SMD/SMT; Height: 0.5mm; Mount: Surface Mount; Case/Package: 0402; Weight: 2.3E-05oz; Dielectric: X5R; Depth: 0.5mm
D7 = DFLS240-7: Diode; Manufacturer_Name: Diodes Incorporated; Datasheet Link: https://www.diodes.com//assets/Datasheets/DFLS240.pdf; Manufacturer_Part_Number: DFLS240-7; Mouser Part Number: 621-DFLS240-7; Mouser Price/Stock: https://www.mouser.co.uk/ProductDetail/Diodes-Incorporated/DFLS240-7?qs=mQbszxtPdlOdicBjJF8M2A%3D%3D; Arrow Part Number: DFLS240-7; Arrow Price/Stock: https://www.arrow.com/en/products/dfls240-7/diodes-incorporated?utm_currency=USD&region=europe
IC4 = TPS5430DDAR: Integrated Circuit; Manufacturer_Name: Texas Instruments; Datasheet Link: http://www.ti.com/lit/gpn/tps5430; Height: 1.7mm; Manufacturer_Part_Number: TPS5430DDAR; Mouser Part Number: 595-TPS5430DDAR; Mouser Price/Stock: https://www.mouser.co.uk/ProductDetail/Texas-Instruments/TPS5430DDAR?qs=zwk82MlA57ZJdOTovH1aYA%3D%3D; Arrow Part Number: TPS5430DDAR; Arrow Price/Stock: https://www.arrow.com/en/products/tps5430ddar/texas-instruments?region=nac
IC5 = LF33CDT-TRY: Integrated Circuit; Manufacturer_Name: STMicroelectronics; Datasheet Link: https://www.st.com/resource/en/datasheet/lfxx.pdf; Height: 2mm; Manufacturer_Part_Number: LF33CDT-TRY; Mouser Part Number: 511-LF33CDT-TRY; Mouser Price/Stock: https://www.mouser.co.uk/ProductDetail/STMicroelectronics/LF33CDT-TRY?qs=fnYUjNMxfVBCqlsIwZoKRw%3D%3D; Arrow Part Number: LF33CDT-TRY; Arrow Price/Stock: https://www.arrow.com/en/products/lf33cdt-try/stmicroelectronics?region=nac
L5 = VLCF5028T-150MR85-2: Inductor; Manufacturer_Name: TDK; Datasheet Link: https://product.tdk.com/system/files/dam/doc/product/inductor/inductor/smd/catalog/inductor_commercial_power_vlcf5028-2_en.pdf; Manufacturer_Part_Number: VLCF5028T-150MR85-2; Mouser Part Number: 810-VLCF528T150MR852; Mouser Price/Stock: https://www.mouser.co.uk/ProductDetail/TDK/VLCF5028T-150MR85-2?qs=uxmvvYJjMIszC3VRfNbrqA%3D%3D; Arrow Part Number: VLCF5028T-150MR85-2; Arrow Price/Stock: https://www.arrow.com/en/products/vlcf5028t-150mr85-2/tdk?region=nac
P1 = CMP-2000-05633-1: PicoBlade(TM) Header, Right Angle, -40 to 85 degC, 2-Pin SMD, RoHS, Tape and Reel; Current - Max: 1A; Brand: Molex; Voltage Rating: 125V; Number of Positions: 2; Pitch: 1.25mm; Package Version: Rev. H, 11/2014; Factory Pack Quantity: 1000; Datasheet URL: http://www.molex.com/webdocs/datasheets/pdf/en-us/0532610271_PCB_HEADERS.pdf; Datasheet Version: 03/2016; Housing Material: Thermoplastic; RoHS: Details; Product Type: Headers; Number of Rows: 1; Termination Style: SMD; Mounting Technology: SurfaceMount; Number of Positions / Contacts: 2; Package URL: http://www.molex.com/pdm_docs/sd/532610271_sd.pdf; Mounting Angle: Right; Mounting Style: SMD/SMT; Manufacturer: Molex; Product Category: 1.25mmConnectors; Tradename: PicoBlade; Voltage - Max: 125V; Manufacturer URL: http://www.molex.com/; Series: 53261; Package Description: 2-Leads Header, Pitch 1.25 mm, Mated Height 3.4 mm; Package Reference: 53261-0271; Current Rating: 1A; Contact Plating: Tin; Contact Material: PhosphorBronze; Type: Shrouded; Packaging: Reel
R10 = CMP-2002-07353-1: Manufacturer: Yageo / Phycomp; Part Number: RC0402FR-0710KL
R12 = CMP-2002-07650-1: Manufacturer: Yageo; Part Number: RC0402FR-073K24L
R13-R15 = CMP-2002-07866-1: Manufacturer: Yageo; Part Number: RC0402FR-13220RL
TP3-TP5 = TP_SMD_Ø1.5MM: 1.5mm circular SMD testpad; Manufacturer: Nordic Semiconductor; Manufacturer Part Number: N.A.; Pad Count: 1; Part Number: TP_SMD_Ø1.5MM; LatestRevisionDate: 2016-06-02; Published: 2016-06-02; Value: Ø1.5mm,SMD; Note: N.A.; Artikkelnr Noca: N.A.; Footprint Doc: TP_SMD_Ø1.5mm; Part number IPS: N.A.; ComponentLink1URL: N.A.; ComponentLink1Description: Datasheet; ComponentLink2URL: N.A.; ComponentLink2Description: Supplier link; HelpURL: N.A.; Supplier 1: N.A.; Supplier Part Number 1: N.A.; Supplier 2: N.A.; Supplier Part Number 2: N.A.; Component Class: Connectors; PartId: 100500477

## Nets that join several sheets
+3V3: um982 (12 pins), IMU (16 pins), POWER (C28.1 IC5.2 R14.2 TP3.1)
+5V0: um982 (6 pins), POWER (8 pins)
GND: um982 (45 pins), IMU (27 pins), POWER (17 pins)
CAN_H: um982 (J1.6), IMU (D8.1 R6.1 U3.7)
CAN_L: um982 (J1.5), IMU (D8.2 R6.2 U3.6)
ERR_STAT: um982 (M1.14), IMU (U1.2)
EVENT: um982 (M1.32), IMU (U1.26)
PPS: um982 (M1.30), IMU (U1.27)
PVT_STAT: um982 (M1.15), IMU (U1.31)
RST: um982 (M1.33), IMU (U1.25)
RTK_STAT: um982 (M1.16), IMU (U1.28)
RXD1: um982 (M1.17), IMU (U1.30)
TXD1: um982 (M1.18), IMU (U1.29)